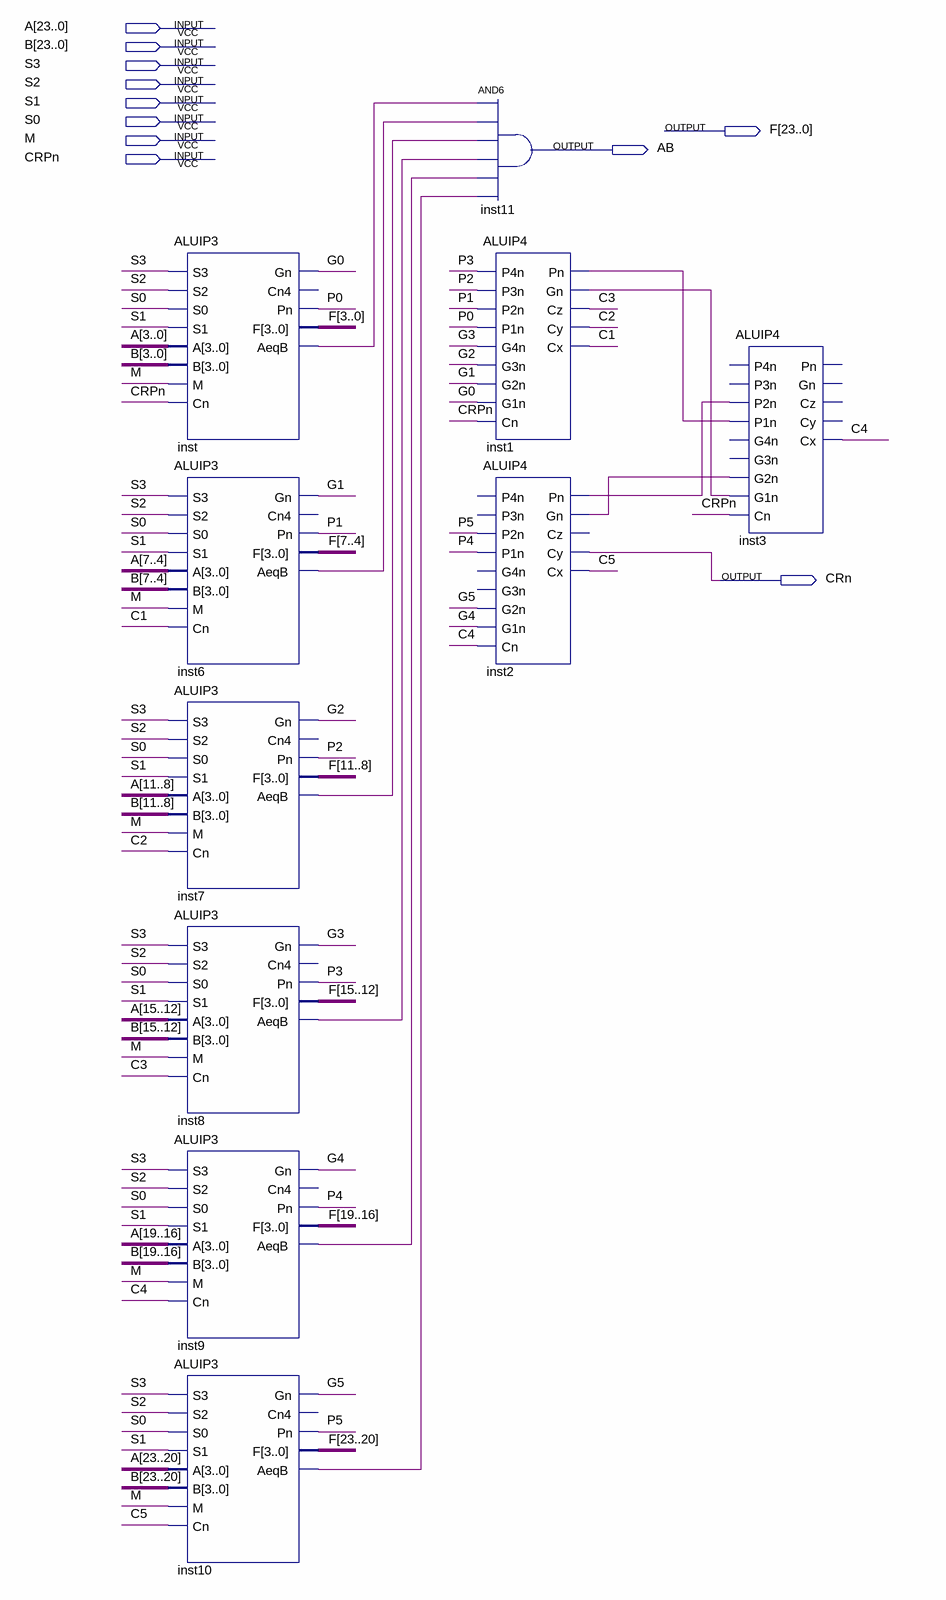
[diagram p0: schematic sheet]
// Quartus schematic ALU24.bdf as structural Verilog: 10 symbols, 11 pins
module ALU24 (
  input  [23:0] A,
  input  [23:0] B,
  input  S3,
  input  S2,
  input  S1,
  input  S0,
  input  M,
  input  CRPn,
  output [23:0] F,
  output AB,
  output CRn
);

  wire C1, C2, C3, C4, C5, G0, G1, G2, G3, G4, G5, inst1_gn, inst1_pn, inst2_gn, inst2_pn, inst6_aeqb,
       inst7_aeqb, inst8_aeqb, inst9_aeqb, inst10_aeqb, inst_aeqb, P0, P1, P2, P3, P4, P5;

  ALUIP3 inst (
    .S3(S3), .S2(S2), .S0(S0), .S1(S1), .A(A[3:0]), .B(B[3:0]), .M(M), .Cn(CRPn), .Gn(G0), .Pn(P0),
    .F(F[3:0]), .AeqB(inst_aeqb));  // open: Cn4
  ALUIP3 inst6 (
    .S3(S3), .S2(S2), .S0(S0), .S1(S1), .A(A[7:4]), .B(B[7:4]), .M(M), .Cn(C1), .Gn(G1), .Pn(P1), .F(F[7:4]),
    .AeqB(inst6_aeqb));  // open: Cn4
  ALUIP3 inst7 (
    .S3(S3), .S2(S2), .S0(S0), .S1(S1), .A(A[11:8]), .B(B[11:8]), .M(M), .Cn(C2), .Gn(G2), .Pn(P2),
    .F(F[11:8]), .AeqB(inst7_aeqb));  // open: Cn4
  ALUIP3 inst8 (
    .S3(S3), .S2(S2), .S0(S0), .S1(S1), .A(A[15:12]), .B(B[15:12]), .M(M), .Cn(C3), .Gn(G3), .Pn(P3),
    .F(F[15:12]), .AeqB(inst8_aeqb));  // open: Cn4
  ALUIP3 inst9 (
    .S3(S3), .S2(S2), .S0(S0), .S1(S1), .A(A[19:16]), .B(B[19:16]), .M(M), .Cn(C4), .Gn(G4), .Pn(P4),
    .F(F[19:16]), .AeqB(inst9_aeqb));  // open: Cn4
  ALUIP3 inst10 (
    .S3(S3), .S2(S2), .S0(S0), .S1(S1), .A(A[23:20]), .B(B[23:20]), .M(M), .Cn(C5), .Gn(G5), .Pn(P5),
    .F(F[23:20]), .AeqB(inst10_aeqb));  // open: Cn4
  and inst11 (AB, inst_aeqb, inst6_aeqb, inst7_aeqb, inst8_aeqb, inst9_aeqb, inst10_aeqb);
  ALUIP4 inst1 (
    .P4n(P3), .P3n(P2), .P2n(P1), .P1n(P0), .G4n(G3), .G3n(G2), .G2n(G1), .G1n(G0), .Cn(CRPn), .Pn(inst1_pn),
    .Gn(inst1_gn), .Cz(C3), .Cy(C2), .Cx(C1));
  ALUIP4 inst2 (
    .P2n(P5), .P1n(P4), .G2n(G5), .G1n(G4), .Cn(C4), .Pn(inst2_pn), .Gn(inst2_gn), .Cy(CRn), .Cx(C5));  // open: P4n, P3n, G4n, G3n, Cz
  ALUIP4 inst3 (
    .P2n(inst2_pn), .P1n(inst1_pn), .G2n(inst2_gn), .G1n(inst1_gn), .Cn(CRPn), .Cx(C4));  // open: P4n, P3n, G4n, G3n, Pn, Gn, Cz, Cy
endmodule
